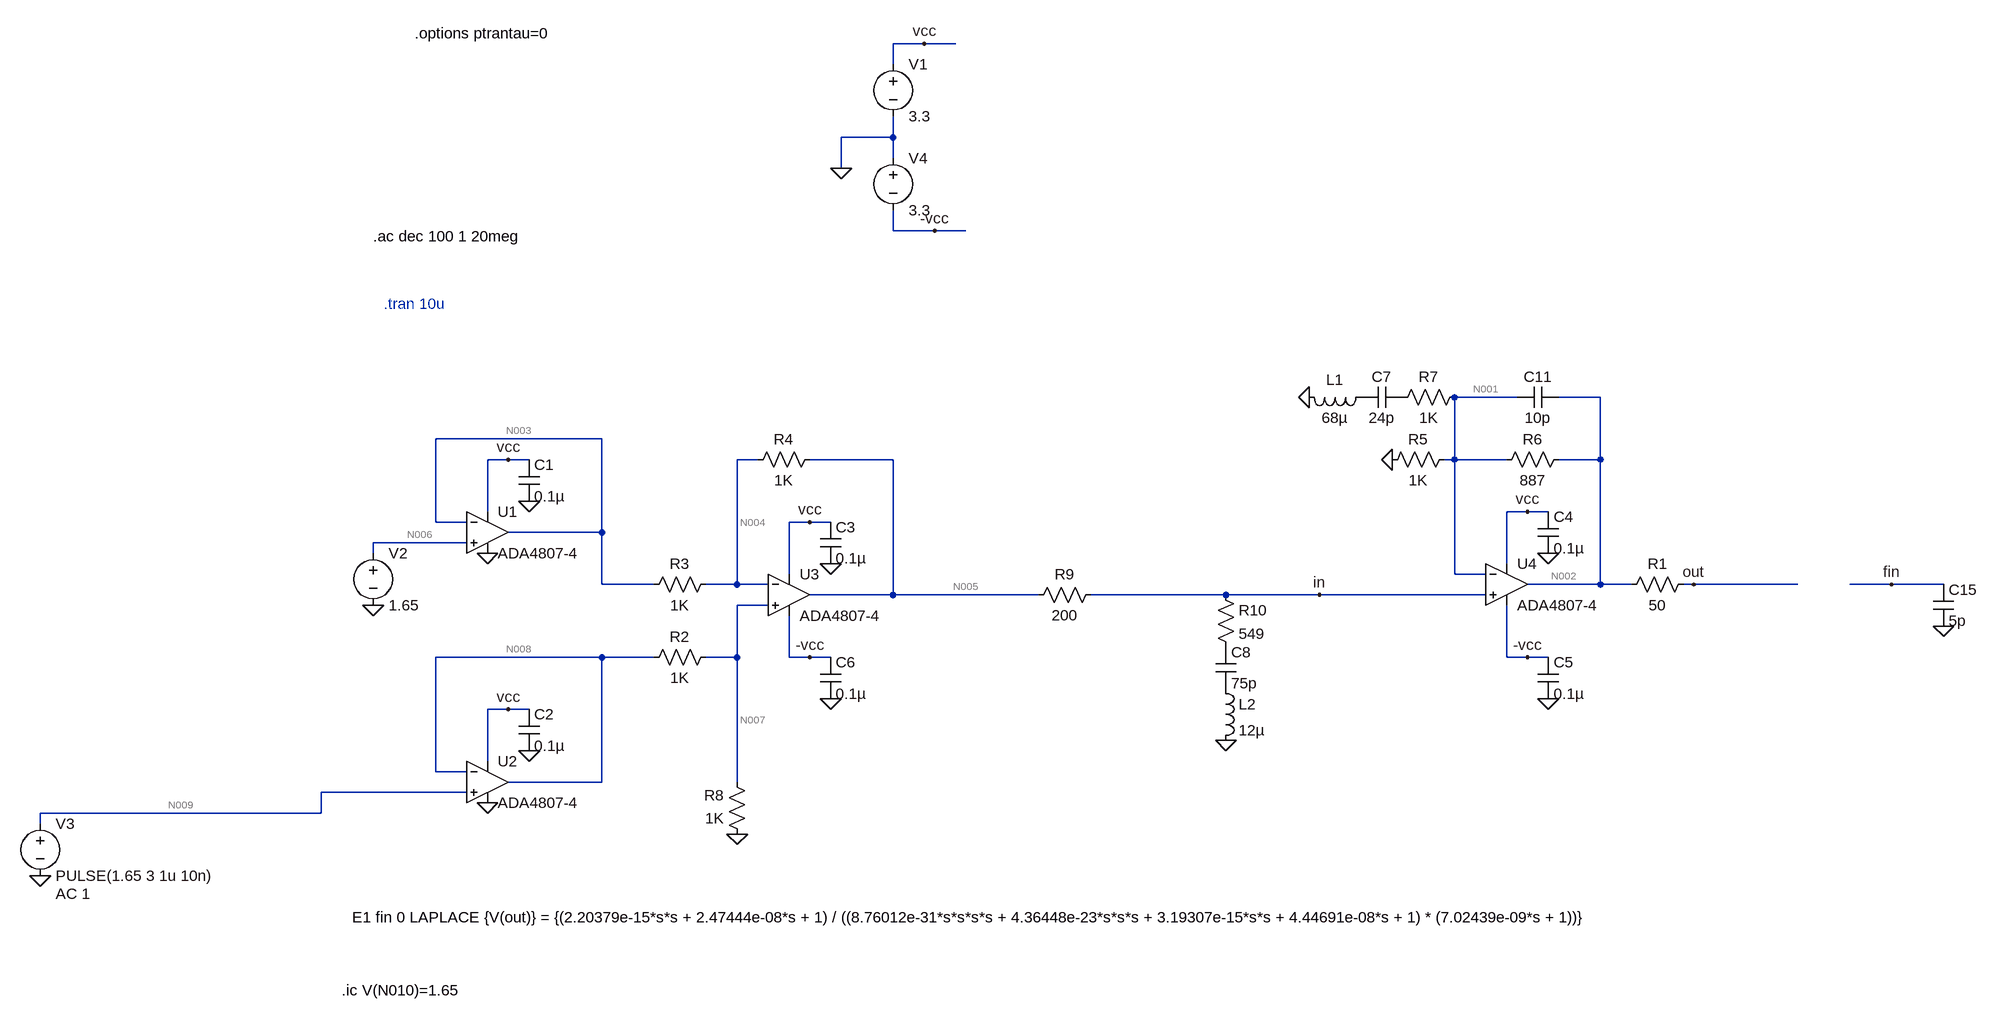
[diagram p0: schematic Draft1.asc]
Draft1.asc, the LTspice schematic file:
Version 4.1
SHEET 1 3136 896
WIRE 832 -576 784 -576
WIRE 880 -576 832 -576
WIRE 784 -544 784 -576
WIRE 784 -432 784 -464
WIRE 784 -432 704 -432
WIRE 784 -400 784 -432
WIRE 704 -384 704 -432
WIRE 784 -288 784 -320
WIRE 848 -288 784 -288
WIRE 896 -288 848 -288
WIRE 1744 -32 1648 -32
WIRE 1872 -32 1808 -32
WIRE 336 32 80 32
WIRE 192 64 160 64
WIRE 224 64 192 64
WIRE 576 64 544 64
WIRE 784 64 656 64
WIRE 1648 64 1648 -32
WIRE 1648 64 1632 64
WIRE 1728 64 1648 64
WIRE 1872 64 1872 -32
WIRE 1872 64 1808 64
WIRE 160 144 160 64
WIRE 1760 144 1728 144
WIRE 1792 144 1760 144
WIRE 80 160 80 32
WIRE 128 160 80 160
WIRE 656 160 624 160
WIRE 688 160 656 160
WIRE 336 176 336 32
WIRE 336 176 192 176
WIRE 128 192 -16 192
WIRE -16 208 -16 192
WIRE 1728 224 1728 144
WIRE 624 240 624 160
WIRE 1648 240 1648 64
WIRE 1696 240 1648 240
WIRE 336 256 336 176
WIRE 416 256 336 256
WIRE 544 256 544 64
WIRE 544 256 496 256
WIRE 592 256 544 256
WIRE 1872 256 1872 64
WIRE 1872 256 1760 256
WIRE 1920 256 1872 256
WIRE 2016 256 2000 256
WIRE 2176 256 2016 256
WIRE 2320 256 2256 256
WIRE 2400 256 2320 256
WIRE 784 272 784 64
WIRE 784 272 656 272
WIRE 1008 272 784 272
WIRE 1296 272 1088 272
WIRE 1440 272 1296 272
WIRE 1696 272 1440 272
WIRE 592 288 544 288
WIRE 336 368 80 368
WIRE 416 368 336 368
WIRE 544 368 544 288
WIRE 544 368 496 368
WIRE 624 368 624 304
WIRE 656 368 624 368
WIRE 688 368 656 368
WIRE 1728 368 1728 288
WIRE 1760 368 1728 368
WIRE 1792 368 1760 368
WIRE 192 448 160 448
WIRE 224 448 192 448
WIRE 160 528 160 448
WIRE 80 544 80 368
WIRE 128 544 80 544
WIRE 336 560 336 368
WIRE 336 560 192 560
WIRE 544 560 544 368
WIRE 128 576 -96 576
WIRE -96 608 -96 576
WIRE -96 608 -528 608
WIRE -528 624 -528 608
FLAG 160 592 0
FLAG 160 208 0
FLAG 1792 208 0
FLAG 688 224 0
FLAG 224 128 0
FLAG 224 512 0
FLAG 832 -576 vcc
FLAG 192 64 vcc
FLAG 192 448 vcc
FLAG 656 160 vcc
FLAG 1760 144 vcc
FLAG -16 288 0
FLAG 544 640 0
FLAG 1552 64 0
FLAG -528 704 0
FLAG 704 -384 0
FLAG 848 -288 -vcc
FLAG 656 368 -vcc
FLAG 1760 368 -vcc
FLAG 1792 432 0
FLAG 688 432 0
FLAG 2400 320 0
FLAG 2016 256 out
FLAG 2320 256 fin
FLAG 1440 272 in
FLAG 1424 -32 0
FLAG 1296 496 0
SYMBOL OpAmps\\ADA4807-4 160 112 R0
SYMATTR InstName U1
SYMBOL OpAmps\\ADA4807-4 160 496 R0
SYMATTR InstName U2
SYMBOL OpAmps\\ADA4807-4 624 208 R0
SYMATTR InstName U3
SYMBOL OpAmps\\ADA4807-4 1728 192 R0
SYMATTR InstName U4
SYMBOL cap 208 64 R0
SYMATTR InstName C1
SYMATTR Value 0.1µ
SYMATTR SpiceLine V=10 Irms=0 Rser=0 Lser=0 mfg="Murata" pn="GCM155R71A104KA55" type="X7R"
SYMBOL cap 208 448 R0
SYMATTR InstName C2
SYMATTR Value 0.1µ
SYMATTR SpiceLine V=10 Irms=0 Rser=0 Lser=0 mfg="Murata" pn="GCM155R71A104KA55" type="X7R"
SYMBOL cap 672 160 R0
SYMATTR InstName C3
SYMATTR Value 0.1µ
SYMATTR SpiceLine V=10 Irms=0 Rser=0 Lser=0 mfg="Murata" pn="GCM155R71A104KA55" type="X7R"
SYMBOL cap 1776 144 R0
SYMATTR InstName C4
SYMATTR Value 0.1µ
SYMATTR SpiceLine V=10 Irms=0 Rser=0 Lser=0 mfg="Murata" pn="GCM155R71A104KA55" type="X7R"
SYMBOL voltage 784 -560 R0
WINDOW 123 0 0 Left 0
WINDOW 39 0 0 Left 0
SYMATTR InstName V1
SYMATTR Value 3.3
SYMBOL voltage -16 192 R0
WINDOW 123 0 0 Left 0
WINDOW 39 0 0 Left 0
SYMATTR InstName V2
SYMATTR Value 1.65
SYMBOL res 1824 48 R90
WINDOW 0 0 56 VBottom 2
WINDOW 3 32 56 VTop 2
SYMATTR InstName R6
SYMATTR Value 887
SYMATTR SpiceLine tol=1 pwr=0.1
SYMBOL voltage -528 608 R0
WINDOW 123 24 124 Left 2
WINDOW 39 0 0 Left 0
SYMATTR Value2 AC 1
SYMATTR InstName V3
SYMATTR Value PULSE(1.65 3 1u 10n)
SYMBOL voltage 784 -416 R0
WINDOW 123 0 0 Left 0
WINDOW 39 0 0 Left 0
SYMATTR InstName V4
SYMATTR Value 3.3
SYMBOL cap 1776 368 R0
SYMATTR InstName C5
SYMATTR Value 0.1µ
SYMATTR SpiceLine V=10 Irms=0 Rser=0 Lser=0 mfg="Murata" pn="GCM155R71A104KA55" type="X7R"
SYMBOL cap 672 368 R0
SYMATTR InstName C6
SYMATTR Value 0.1µ
SYMATTR SpiceLine V=10 Irms=0 Rser=0 Lser=0 mfg="Murata" pn="GCM155R71A104KA55" type="X7R"
SYMBOL cap 2384 256 R0
SYMATTR InstName C15
SYMATTR Value 5p
SYMBOL res 512 352 R90
WINDOW 0 0 56 VBottom 2
WINDOW 3 32 56 VTop 2
SYMATTR InstName R2
SYMATTR Value 1K
SYMATTR SpiceLine tol=1 pwr=0.1
SYMBOL res 512 240 R90
WINDOW 0 0 56 VBottom 2
WINDOW 3 32 56 VTop 2
SYMATTR InstName R3
SYMATTR Value 1K
SYMATTR SpiceLine tol=1 pwr=0.1
SYMBOL res 672 48 R90
WINDOW 0 0 56 VBottom 2
WINDOW 3 32 56 VTop 2
SYMATTR InstName R4
SYMATTR Value 1K
SYMATTR SpiceLine tol=1 pwr=0.1
SYMBOL res 560 656 R180
WINDOW 0 36 76 Left 2
WINDOW 3 36 40 Left 2
SYMATTR InstName R8
SYMATTR Value 1K
SYMATTR SpiceLine tol=1 pwr=0.1
SYMBOL res 1648 48 R90
WINDOW 0 0 56 VBottom 2
WINDOW 3 32 56 VTop 2
SYMATTR InstName R5
SYMATTR Value 1K
SYMATTR SpiceLine tol=1 pwr=0.1
SYMBOL res 2016 240 R90
WINDOW 0 0 56 VBottom 2
WINDOW 3 32 56 VTop 2
SYMATTR InstName R1
SYMATTR Value 50
SYMBOL res 1104 256 R90
WINDOW 0 0 56 VBottom 2
WINDOW 3 32 56 VTop 2
SYMATTR InstName R9
SYMATTR Value 200
SYMATTR SpiceLine tol=1 pwr=0.1
SYMBOL cap 1808 -48 R90
WINDOW 0 0 32 VBottom 2
WINDOW 3 32 32 VTop 2
SYMATTR InstName C11
SYMATTR Value 10p
SYMATTR SpiceLine Rser=10
SYMBOL res 1664 -48 R90
WINDOW 0 0 56 VBottom 2
WINDOW 3 32 56 VTop 2
SYMATTR InstName R7
SYMATTR Value 1K
SYMATTR SpiceLine tol=1 pwr=0.1
SYMBOL cap 1568 -48 R90
WINDOW 0 0 32 VBottom 2
WINDOW 3 32 32 VTop 2
SYMATTR InstName C7
SYMATTR Value 24p
SYMATTR SpiceLine Rser=10
SYMBOL ind 1520 -48 R90
WINDOW 0 5 56 VBottom 2
WINDOW 3 32 56 VTop 2
SYMATTR InstName L1
SYMATTR Value 68µ
SYMATTR SpiceLine Rser=1m
SYMBOL res 1280 256 R0
SYMATTR InstName R10
SYMATTR Value 549
SYMATTR SpiceLine tol=1 pwr=0.1
SYMBOL cap 1280 352 R0
SYMATTR InstName C8
SYMATTR Value 75p
SYMATTR SpiceLine Rser=10
SYMBOL ind 1280 400 R0
SYMATTR InstName L2
SYMATTR Value 12µ
SYMATTR SpiceLine Rser=1m
TEXT 0 -176 Left 2 ;.tran 10u
TEXT -16 -280 Left 2 !.ac dec 100 1 20meg
TEXT -64 880 Left 2 !.ic V(N010)=1.65
TEXT -48 768 Left 2 !E1 fin 0 LAPLACE {V(out)} = {(2.20379e-15*s*s + 2.47444e-08*s + 1) / ((8.76012e-31*s*s*s*s + 4.36448e-23*s*s*s + 3.19307e-15*s*s + 4.44691e-08*s + 1) * (7.02439e-09*s + 1))}
TEXT 48 -592 Left 2 !.options ptrantau=0

The netlist it stands for:
* Draft1.asc
X§U1 N006 N003 vcc 0 N003 ADA4807-4  ; pins In+ In- V+ V- OUT
X§U2 N009 N008 vcc 0 N008 ADA4807-4  ; pins In+ In- V+ V- OUT
X§U3 N007 N004 vcc -vcc N005 ADA4807-4  ; pins In+ In- V+ V- OUT
X§U4 in N001 vcc -vcc N002 ADA4807-4  ; pins In+ In- V+ V- OUT
C1 vcc 0 0.1µ V=10 Irms=0 Rser=0 Lser=0 mfg="Murata" pn="GCM155R71A104KA55" type="X7R"
C2 vcc 0 0.1µ V=10 Irms=0 Rser=0 Lser=0 mfg="Murata" pn="GCM155R71A104KA55" type="X7R"
C3 vcc 0 0.1µ V=10 Irms=0 Rser=0 Lser=0 mfg="Murata" pn="GCM155R71A104KA55" type="X7R"
C4 vcc 0 0.1µ V=10 Irms=0 Rser=0 Lser=0 mfg="Murata" pn="GCM155R71A104KA55" type="X7R"
V1 vcc 0 3.3
V2 N006 0 1.65
R6 N002 N001 887 tol=1 pwr=0.1
V3 N009 0 PULSE(1.65 3 1u 10n) AC 1
V4 0 -vcc 3.3
C5 -vcc 0 0.1µ V=10 Irms=0 Rser=0 Lser=0 mfg="Murata" pn="GCM155R71A104KA55" type="X7R"
C6 -vcc 0 0.1µ V=10 Irms=0 Rser=0 Lser=0 mfg="Murata" pn="GCM155R71A104KA55" type="X7R"
C15 fin 0 5p
R2 N007 N008 1K tol=1 pwr=0.1
R3 N004 N003 1K tol=1 pwr=0.1
R4 N005 N004 1K tol=1 pwr=0.1
R8 0 N007 1K tol=1 pwr=0.1
R5 N001 0 1K tol=1 pwr=0.1
R1 out N002 50
R9 in N005 200 tol=1 pwr=0.1
C11 N002 N001 10p Rser=10
R7 N001 P001 1K tol=1 pwr=0.1
C7 P001 P002 24p Rser=10
L1 P002 0 68µ Rser=1m
R10 in P003 549 tol=1 pwr=0.1
C8 P003 P004 75p Rser=10
L2 P004 0 12µ Rser=1m
* .tran 10u
.ac dec 100 1 20meg
.ic V(N010)=1.65
E1 fin 0 LAPLACE {V(out)} = {(2.20379e-15*s*s + 2.47444e-08*s + 1) / ((8.76012e-31*s*s*s*s + 4.36448e-23*s*s*s + 3.19307e-15*s*s + 4.44691e-08*s + 1) * (7.02439e-09*s + 1))}
.options ptrantau=0
.backanno
.end

* Results of the author's LTspice run, read from the files saved beside the schematic
* Operating Point, zero values left out:
*   V(-vcc) = -3.3 V
*   V(fin) = -564.5 µV
*   V(in) = 258.3 µV
*   V(n001) = 269.1 µV
*   V(n002) = -564.5 µV
*   V(n003) = 1.65 V
*   V(n004) = 825.6 mV
*   V(n005) = 18.29 µV
*   V(n006) = 1.65 V
*   V(n007) = 825.6 mV
*   V(n008) = 1.65 V
*   V(n009) = 1.65 V
*   V(out) = -564.5 µV
*   V(p001) = 269.1 µV
*   V(p003) = 258.3 µV
*   V(vcc) = 3.3 V
*   I(R2) = -824.4 µA
*   I(R3) = -824.4 µA
*   I(R4) = -825.6 µA
*   I(R5) = 269.1 nA
*   I(R6) = -939.8 nA
*   I(R8) = -825.6 µA
*   I(R9) = 1.2 µA
*   I(V1) = -5.646 mA
*   I(V2) = 1.2 µA
*   I(V3) = 1.2 µA
*   I(V4) = -2.828 mA
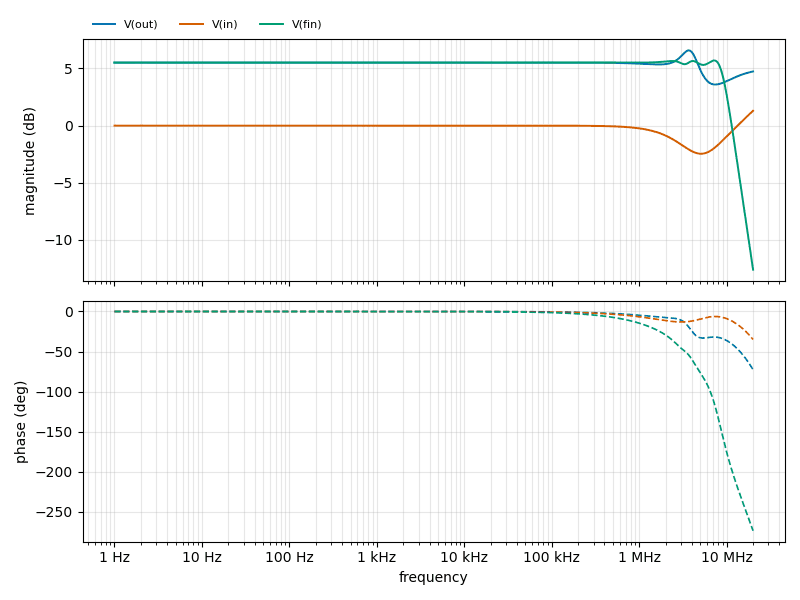
[diagram p1: AC Analysis of Draft1.asc, plotted from the saved traces]
* AC Analysis, 1 run:
*   V(out): 5.52 dB at 1 Hz, 4.74 dB at 20 MHz, peak 6.58 dB at 3.715 MHz
*   V(in): 0.00 dB at 1 Hz, 1.30 dB at 20 MHz, peak 1.30 dB at 20 MHz, 3 dB below the peak at 7.871 MHz
*   V(fin): 5.52 dB at 1 Hz, -12.61 dB at 20 MHz, peak 5.70 dB at 7.244 MHz, 3 dB below the peak at 9.981 MHz